# EAGLE schematic T-11_Version_1_1 (EAGLE 7.1.0)
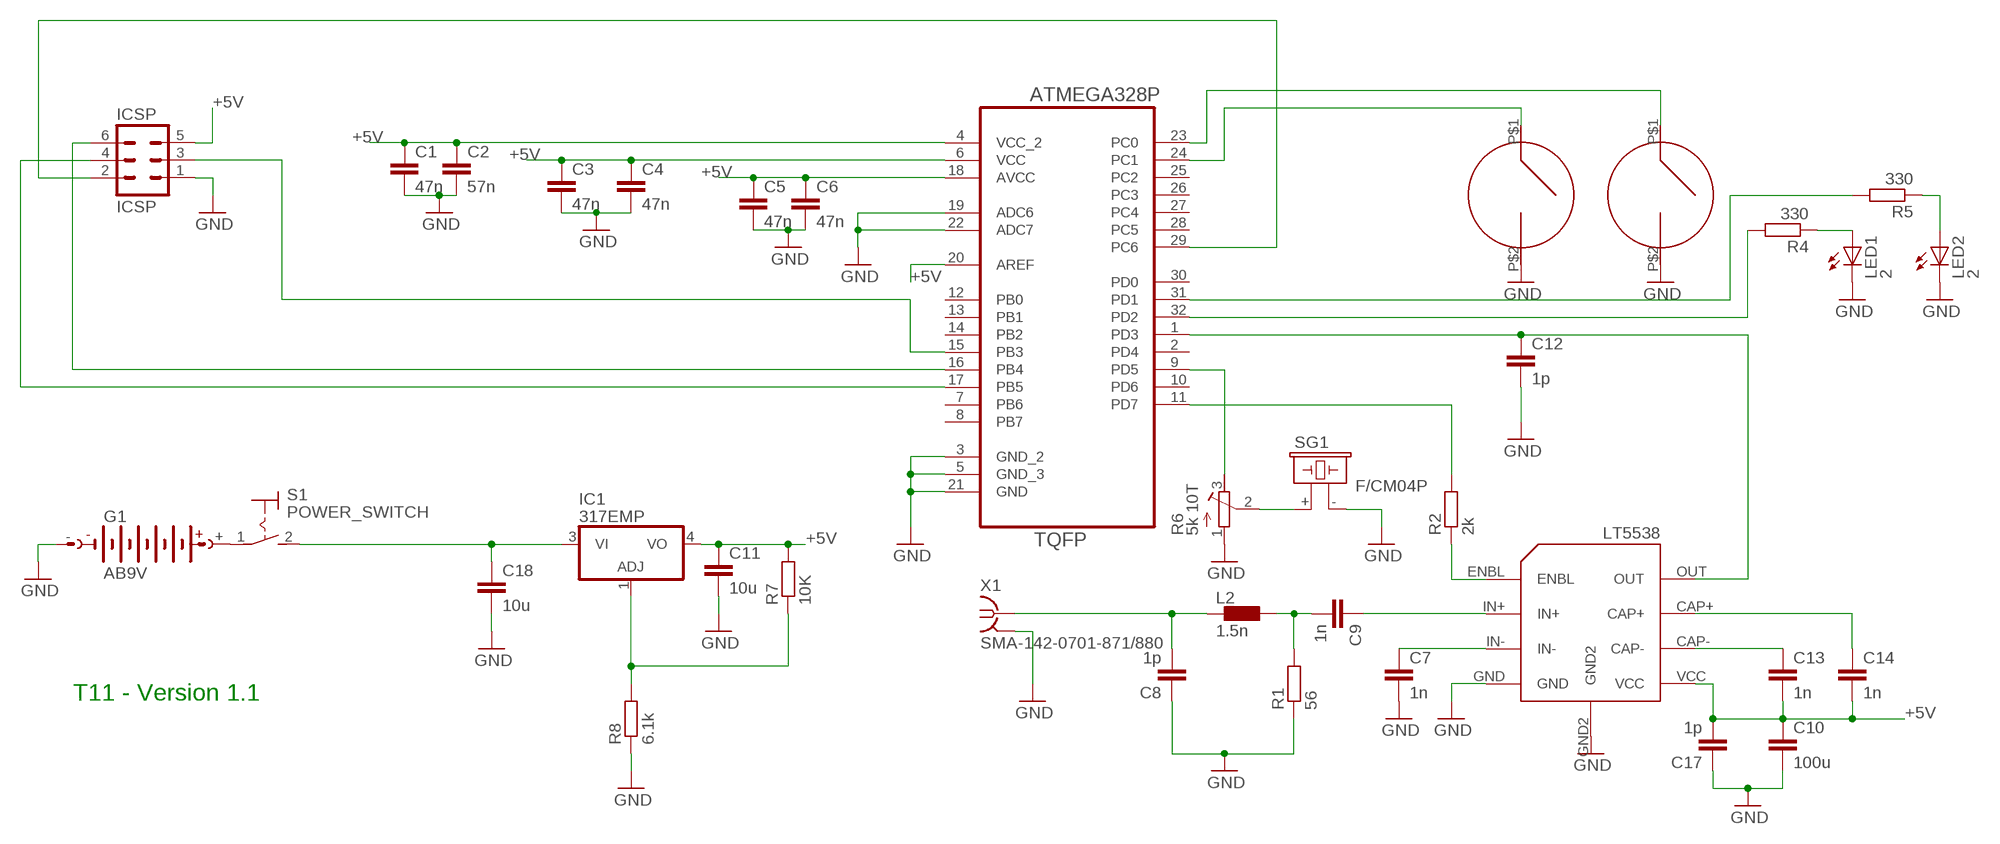
[diagram p0: schematic, sheet 1]

## Parts
C1  47n  CC4532  [C4532]
C2  57n  CC4532  [C4532]
C3  47n  CC4532  [C4532]
C4  47n  CC4532  [C4532]
C5  47n  CC4532  [C4532]
C6  47n  CC4532  [C4532]
C7  1n  CC4532  [C4532]
C8  1p  CC4532  [C4532]
C9  1n  CC4532  [C4532]
C10  100u  CC4532  [C4532]
C11  10u  CC4532  [C4532]
C12  1p  C  [C0805]
C13  1n  CC4532  [C4532]
C14  1n  CC4532  [C4532]
C17  1p  CC4532  [C4532]
C18  10u  CC4532  [C4532]
G1  AB9V  [AB9V]
IC1  317EMP  [SOT223]
ICSP  ICSP  MA03-2  [MA03-2]
L2  1.5n  LL4532P  [L4532P]
LED1  2  LED3MM  [LED3MM]
LED2  2  LED3MM  [LED3MM]
R1  56  RR3225  [R3225]
R2  2k  RR3225  [R3225]
R4  330  RR3225  [R3225]
R5  330  RR3225  [R3225]
R6  5k 10T  R-TRIMMTS63Y  [RTRIMTS63Y]
R7  10K  RR3225  [R3225]
R8  6.1k  RR3225  [R3225]
S1  POWER_SWITCH  MS243  [MS243]
SG1  F/CM04P  [F/CM04P]
U1  ATMEGA328P-AU  [QFP80P900X900X120-32N]
U$1  LT5538  [LT5538]
U$2  SW-1801X  [SW-1801X]
U$3  SW-1801X  [SW-1801X]
X1  SMA-142-0701-871/880  [SMA-142-0701-871]

## Nets
+5V: C1.1 C2.1 C3.1 C4.1 C5.1 C6.1 C10.1 C11.1 C13.2 C14.2 C17.2 IC1.4(VO) ICSP.5 R7.2 U1.4(VCC_2) U1.6(VCC) U1.18(AVCC) U1.20(AREF) U$1.VCC
GND: C1.2 C2.2 C3.2 C4.2 C5.2 C6.2 C7.2 C8.1 C10.2 C11.2 C12.2 C17.1 C18.2 G1.- ICSP.1 LED1.K(C) LED2.K(C) R1.1 R6.1(A) R8.1 SG1.- U1.3(GND_2) U1.5(GND_3) U1.19(ADC6) U1.21(GND) U1.22(ADC7) U$1.GND U$1.GND2 U$2.P$2 U$3.P$2 X1.2@1 X1.2@2 X1.2@3 X1.2@4
MISO: ICSP.6 U1.16(PB4)
MOSI: ICSP.3 U1.15(PB3)
N$1: C7.1 U$1.IN-
N$2: C9.1 U$1.IN+
N$3: C9.2 L2.1 R1.2
N$4: C8.2 L2.2 X1.1
N$5: C13.1 U$1.CAP-
N$6: R2.1 U$1.ENBL
N$7: R2.2 U1.11(PD7)
N$8: C14.1 U$1.CAP+
N$9: C12.1 U1.1(PD3) U$1.OUT
N$12: U1.23(PC0) U$2.P$1
N$13: U1.24(PC1) U$3.P$1
N$14: R5.2 U1.31(PD1)
N$15: G1.+ S1.1(P)
N$17: R4.2 U1.32(PD2)
N$20: LED1.A R4.1
N$21: LED2.A R5.1
N$22: R6.3(E) U1.9(PD5)
N$24: R6.2(S) SG1.+
N$25: C18.1 IC1.3(VI) S1.2(S)
N$27: IC1.1(ADJ) R7.1 R8.2
RESET: ICSP.2 U1.29(PC6)
SCK: ICSP.4 U1.17(PB5)
Unconnected: U1.2(PD4) U1.7(PB6) U1.8(PB7) U1.10(PD6) U1.12(PB0) U1.13(PB1) U1.14(PB2) U1.25(PC2) U1.26(PC3) U1.27(PC4) U1.28(PC5) U1.30(PD0)

## Notes on the sheet
- T11 - Version 1.1

## Library data of the parts
C1-C11 C13 C14 C17 C18 = eagle-ltspice:C: CAPACITOR, European symbol; SPICEMODEL: NONE; SPICEPREFIX: C
C12 = eagle-ltspice:C: CAPACITOR, European symbol; SPICEMODEL: 1p; SPICEPREFIX: C
G1 = battery:AB9V: 9-V BATTERY CLIP
IC1 = linear:*317: Positive VOLTAGE REGULATOR
ICSP = con-lstb:MA03-2: PIN HEADER; OC_FARNELL: unknown; OC_NEWARK: unknown
L2 = eagle-ltspice:L: INDUCTOR, European symbol; SPICEMODEL: NONE; SPICEPREFIX: L
LED1 LED2 = led:LED: LED OSRAM: - CHIPLED LG R971, LG N971, LY N971, LG Q971, LY Q971, LO R971, LY R971 LH N974, LH R974 LS Q976, LO Q976, LY Q976 LO Q996 - Hyper CHIPLED LW Q18S LB Q993, LB Q99A, LB R99A - SideLED LS A670, LO A670, LY A670, LG A670, LP A670 LB A673, LV A673, LT A673, LW A673 LH A674 LY A675 LS A676, LA A676, LO A676, LY A676, LW A676 LS A679, LY A679, LG A679 - Hyper Micro SIDELED® LS Y876, LA Y876, LO Y876, LY Y876 LT Y87S - SmartLED LW L88C, LW L88S LB L89C, LB L89S, LG L890 LS L89K, LO L89K, LY L89K LS L896, LA L896, LO L896, LY L896 - TOPLED LS T670, LO T670, LY T670, LG T670, LP T670 LSG T670, LSP T670, LSY T670, LOP T670, LYG T670 LG T671, LOG T671, LSG T671 LB T673, LV T673, LT T673, LW T673 LH T674 LS T676, LA T676, LO T676, LY T676, LB T676, LH T676, LSB T676, LW T676 LB T67C, LV T67C, LT T67C, LS T67K, LO T67K, LY T67K, LW E67C LS E67B, LA E67B, LO E67B, LY E67B, LB E67C, LV E67C, LT E67C LW T67C LS T679, LY T679, LG T679 LS T770, LO T770, LY T770, LG T770, LP T770 LB T773, LV T773, LT T773, LW T773 LH T774 LS E675, LA E675, LY E675, LS T675 LS T776, LA T776, LO T776, LY T776, LB T776 LHGB T686 LT T68C, LB T68C - Hyper Mini TOPLED® LB M676 - Mini TOPLED Santana® LG M470 LS M47K, LO M47K, LY M47K Source: http://www.osram.convergy.de LUXEON: - LUMILED® LXK2-PW12-R00, LXK2-PW12-S00, LXK2-PW14-U00, LXK2-PW14-V00 LXK2-PM12-R00, LXK2-PM12-S00, LXK2-PM14-U00 LXK2-PE12-Q00, LXK2-PE12-R00, LXK2-PE12-S00, LXK2-PE14-T00, LXK2-PE14-U00 LXK2-PB12-K00, LXK2-PB12-L00, LXK2-PB12-M00, LXK2-PB14-N00, LXK2-PB14-P00, LXK2-PB14-Q00 LXK2-PR12-L00, LXK2-PR12-M00, LXK2-PR14-Q00, LXK2-PR14-R00 LXK2-PD12-Q00, LXK2-PD12-R00, LXK2-PD12-S00 LXK2-PH12-R00, LXK2-PH12-S00 LXK2-PL12-P00, LXK2-PL12-Q00, LXK2-PL12-R00 Source: www.luxeon.com KINGBRIGHT: KA-3528ASYC Source: www.kingbright.com
R1 R2 R4 R5 R7 R8 = eagle-ltspice:R: RESISTOR, European symbol; SPICEMODEL: NONE; SPICEPREFIX: R
R6 = rcl:R-TRIMM: Trimm resistor
S1 = switch:MS243: TOGGLE SWITCH
SG1 = buzzer:F/CM04P: BUZZER Source: Buerklin; OC_FARNELL: unknown; OC_NEWARK: unknown
U1 = Ava:ATMEGA328P-AU; DESCRIPTION: 8-bit Microcontroller with In-System Programmable Flash; MPN: ATMEGA328P-AU; OC_FARNELL: 1715486; OC_NEWARK: 14R4631; PACKAGE: TQFP-32; SUPPLIER: Atmel
U$1 = LT5538:LT5538
U$2 U$3 = SW18xxx:SW-1801X
X1 = con-coax:SMA-: SMA 50 Ohm End Launch Jack Receptacle - Round Contact Johnson Components Source: www.johnsoncomponents.com .. J502-ND.pdf; MF: JOHNSON COMPONENTS; MPN: 142-0701-871; OC_FARNELL: 1339835; OC_NEWARK: 91B6105